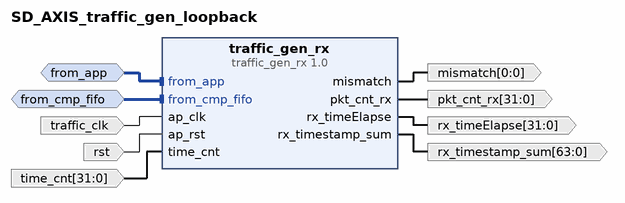
[diagram p0: block diagram of the top level]
# Vivado block design SD_AXIS_traffic_gen_loopback, xczu19eg-ffvc1760-2-i, Vivado 2019.1
create_bd_design SD_AXIS_traffic_gen_loopback

create_bd_intf_port -mode Slave -vlnv xilinx.com:interface:axis_rtl:1.0 from_app
set_property -dict [list \
  CONFIG.HAS_TKEEP 1 \
  CONFIG.HAS_TLAST 1 \
  CONFIG.HAS_TREADY 1 \
  CONFIG.HAS_TSTRB 0 \
  CONFIG.LAYERED_METADATA undef \
  CONFIG.TDATA_NUM_BYTES 64 \
  CONFIG.TDEST_WIDTH 0 \
  CONFIG.TID_WIDTH 0 \
  CONFIG.TUSER_WIDTH 0 \
] [get_bd_intf_ports from_app]
create_bd_intf_port -mode Slave -vlnv xilinx.com:interface:axis_rtl:1.0 from_cmp_fifo
set_property -dict [list \
  CONFIG.HAS_TKEEP 1 \
  CONFIG.HAS_TLAST 1 \
  CONFIG.HAS_TREADY 1 \
  CONFIG.HAS_TSTRB 0 \
  CONFIG.LAYERED_METADATA undef \
  CONFIG.TDATA_NUM_BYTES 64 \
  CONFIG.TDEST_WIDTH 0 \
  CONFIG.TID_WIDTH 0 \
  CONFIG.TUSER_WIDTH 0 \
] [get_bd_intf_ports from_cmp_fifo]
create_bd_port -dir I -type clk traffic_clk
create_bd_port -dir I -type rst rst
create_bd_port -dir O -from 0 -to 0 mismatch
create_bd_port -dir O -from 31 -to 0 pkt_cnt_rx
create_bd_port -dir O -from 31 -to 0 rx_timeElapse
create_bd_port -dir O -from 63 -to 0 rx_timestamp_sum
create_bd_port -dir I -from 31 -to 0 time_cnt

create_bd_cell -type ip -vlnv clarkshen.com:user:traffic_gen_rx:1.0 traffic_gen_rx

# ---- connections ----

connect_bd_intf_net -intf_net from_app_0_1 [get_bd_intf_ports from_app] [get_bd_intf_pins traffic_gen_rx/from_app]
connect_bd_intf_net -intf_net from_cmp_fifo_0_1 [get_bd_intf_ports from_cmp_fifo] [get_bd_intf_pins traffic_gen_rx/from_cmp_fifo]
connect_bd_net -net ap_clk_0_1 [get_bd_ports traffic_clk] [get_bd_pins traffic_gen_rx/ap_clk]
connect_bd_net -net ap_rst_0_1 [get_bd_ports rst] [get_bd_pins traffic_gen_rx/ap_rst]
connect_bd_net [get_bd_pins traffic_gen_rx/mismatch] [get_bd_ports mismatch]
connect_bd_net [get_bd_pins traffic_gen_rx/pkt_cnt_rx] [get_bd_ports pkt_cnt_rx]
connect_bd_net [get_bd_pins traffic_gen_rx/rx_timeElapse] [get_bd_ports rx_timeElapse]
connect_bd_net [get_bd_pins traffic_gen_rx/rx_timestamp_sum] [get_bd_ports rx_timestamp_sum]
connect_bd_net -net time_cnt_0_1 [get_bd_ports time_cnt] [get_bd_pins traffic_gen_rx/time_cnt]

validate_bd_design
save_bd_design
